# EAGLE design Protoboard (EAGLE 6.4)
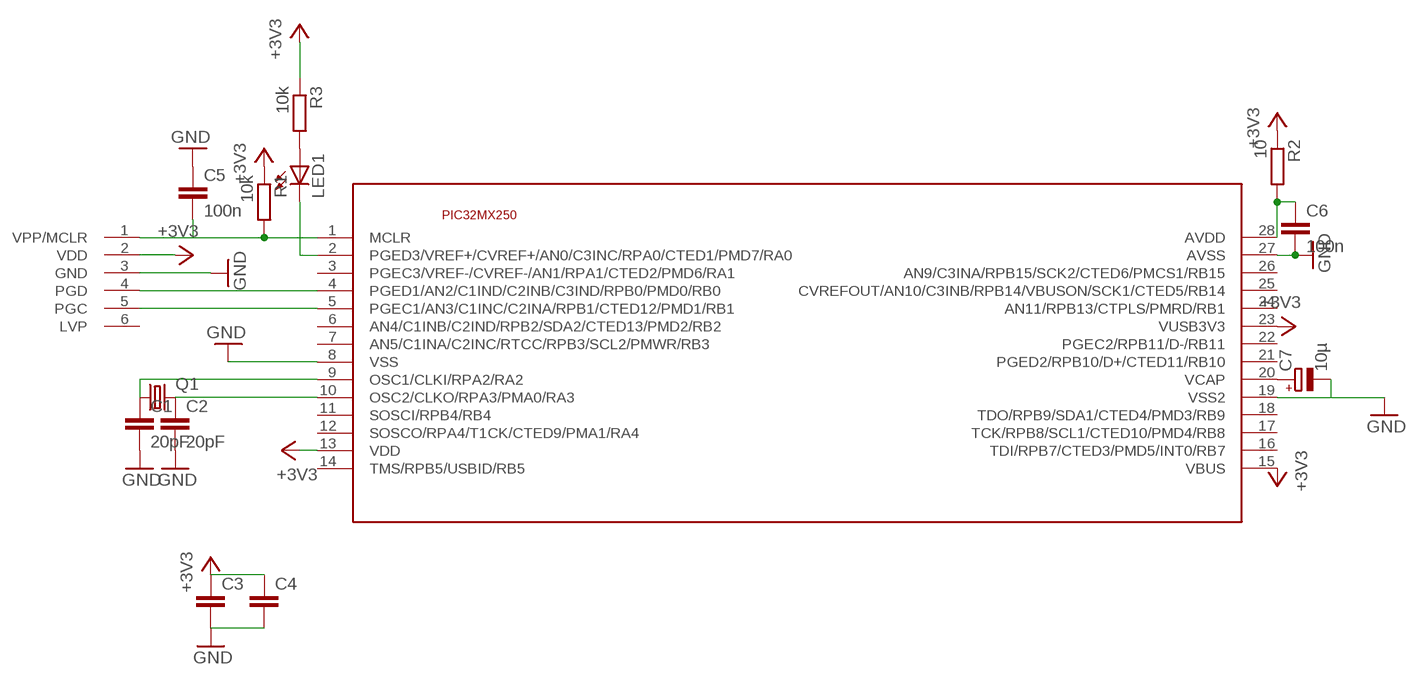
[diagram p0: schematic, sheet 1]

## Parts
C1  20pF  C-EU050-024X044  [C050-024X044]
C2  20pF  C-EU050-024X044  [C050-024X044]
C3  C-EU050-024X044  [C050-024X044]
C4  C-EU050-024X044  [C050-024X044]
C5  100n  C-EU050-024X044  [C050-024X044]
C6  100n  C-EU050-024X044  [C050-024X044]
C7  10µ  CPOL-EUB45181B  [B45181B]
LED1  LED5MM  [LED5MM]
Q1  CRYSTALTC26V  [TC26V]
R1  10k  R-EU_0207/10  [0207/10]
R2  10  R-EU_0207/10  [0207/10]
R3  10k  R-EU_0207/10  [0207/10]
U$2  ICSP-6_6P  [1X06-CLEANBIG]
U$3  PIC32MX2XXSOIC  [SOIC28]

## Nets
+3V3: C3.1 C4.1 R1.1 R2.1 R3.1 U$2.2(VDD) U$3.13(VDD) U$3.15(VBUS) U$3.23(VUSB3V3)
GND: C1.2 C2.2 C3.2 C4.2 C5.1 C6.2 C7.- U$2.3(GND) U$3.8(VSS) U$3.19(VSS2) U$3.27(AVSS)
N$1: C2.1 Q1.2 U$3.10(OSC2/CLKO/RPA3/PMA0/RA3)
N$2: C5.2 R1.2 U$2.1(VPP/MCLR) U$3.1(MCLR)
N$3: U$2.5(PGC) U$3.5(PGEC1/AN3/C1INC/C2INA/RPB1/CTED12/PMD1/RB1)
N$4: C1.1 Q1.1 U$3.9(OSC1/CLKI/RPA2/RA2)
N$5: U$2.4(PGD) U$3.4(PGED1/AN2/C1IND/C2INB/C3IND/RPB0/PMD0/RB0)
N$6: LED1.K(C) U$3.2(PGED3/VREF+/CVREF+/AN0/C3INC/RPA0/CTED1/PMD7/RA0)
N$7: C7.+ U$3.20(VCAP)
N$8: C6.1 R2.2 U$3.28(AVDD)
N$9: LED1.A R3.2
Unconnected: U$2.6(LVP) U$3.3(PGEC3/VREF-/CVREF-/AN1/RPA1/CTED2/PMD6/RA1) U$3.6(AN4/C1INB/C2IND/RPB2/SDA2/CTED13/PMD2/RB2) U$3.7(AN5/C1INA/C2INC/RTCC/RPB3/SCL2/PMWR/RB3) U$3.11(SOSCI/RPB4/RB4) U$3.12(SOSCO/RPA4/T1CK/CTED9/PMA1/RA4) U$3.14(TMS/RPB5/USBID/RB5) U$3.16(TDI/RPB7/CTED3/PMD5/INT0/RB7) U$3.17(TCK/RPB8/SCL1/CTED10/PMD4/RB8) U$3.18(TDO/RPB9/SDA1/CTED4/PMD3/RB9) U$3.21(PGED2/RPB10/D+/CTED11/RB10) U$3.22(PGEC2/RPB11/D-/RB11) U$3.24(AN11/RPB13/CTPLS/PMRD/RB1) U$3.25(CVREFOUT/AN10/C3INB/RPB14/VBUSON/SCK1/CTED5/RB14) U$3.26(AN9/C3INA/RPB15/SCK2/CTED6/PMCS1/RB15)

## Library data of the parts
C1-C6 = rcl:C-EU: CAPACITOR, European symbol
C7 = rcl:CPOL-EU: POLARIZED CAPACITOR, European symbol
LED1 = led:LED: LED OSRAM: - CHIPLED LG R971, LG N971, LY N971, LG Q971, LY Q971, LO R971, LY R971 LH N974, LH R974 LS Q976, LO Q976, LY Q976 LO Q996 - Hyper CHIPLED LW Q18S LB Q993, LB Q99A, LB R99A - SideLED LS A670, LO A670, LY A670, LG A670, LP A670 LB A673, LV A673, LT A673, LW A673 LH A674 LY A675 LS A676, LA A676, LO A676, LY A676, LW A676 LS A679, LY A679, LG A679 - Hyper Micro SIDELED® LS Y876, LA Y876, LO Y876, LY Y876 LT Y87S - SmartLED LW L88C, LW L88S LB L89C, LB L89S, LG L890 LS L89K, LO L89K, LY L89K LS L896, LA L896, LO L896, LY L896 - TOPLED LS T670, LO T670, LY T670, LG T670, LP T670 LSG T670, LSP T670, LSY T670, LOP T670, LYG T670 LG T671, LOG T671, LSG T671 LB T673, LV T673, LT T673, LW T673 LH T674 LS T676, LA T676, LO T676, LY T676, LB T676, LH T676, LSB T676, LW T676 LB T67C, LV T67C, LT T67C, LS T67K, LO T67K, LY T67K, LW E67C LS E67B, LA E67B, LO E67B, LY E67B, LB E67C, LV E67C, LT E67C LW T67C LS T679, LY T679, LG T679 LS T770, LO T770, LY T770, LG T770, LP T770 LB T773, LV T773, LT T773, LW T773 LH T774 LS E675, LA E675, LY E675, LS T675 LS T776, LA T776, LO T776, LY T776, LB T776 LHGB T686 LT T68C, LB T68C - Hyper Mini TOPLED® LB M676 - Mini TOPLED Santana® LG M470 LS M47K, LO M47K, LY M47K Source: http://www.osram.convergy.de LUXEON: - LUMILED® LXK2-PW12-R00, LXK2-PW12-S00, LXK2-PW14-U00, LXK2-PW14-V00 LXK2-PM12-R00, LXK2-PM12-S00, LXK2-PM14-U00 LXK2-PE12-Q00, LXK2-PE12-R00, LXK2-PE12-S00, LXK2-PE14-T00, LXK2-PE14-U00 LXK2-PB12-K00, LXK2-PB12-L00, LXK2-PB12-M00, LXK2-PB14-N00, LXK2-PB14-P00, LXK2-PB14-Q00 LXK2-PR12-L00, LXK2-PR12-M00, LXK2-PR14-Q00, LXK2-PR14-R00 LXK2-PD12-Q00, LXK2-PD12-R00, LXK2-PD12-S00 LXK2-PH12-R00, LXK2-PH12-S00 LXK2-PL12-P00, LXK2-PL12-Q00, LXK2-PL12-R00 Source: www.luxeon.com KINGBRIGHT: KA-3528ASYC Source: www.kingbright.com
Q1 = adafruit:CRYSTAL: CRYSTAL; OC_FARNELL: unknown; OC_NEWARK: unknown
R1-R3 = rcl:R-EU_: RESISTOR, European symbol
U$2 = lieven:ICSP-6
U$3 = lieven:PIC32MX2XX

## Board
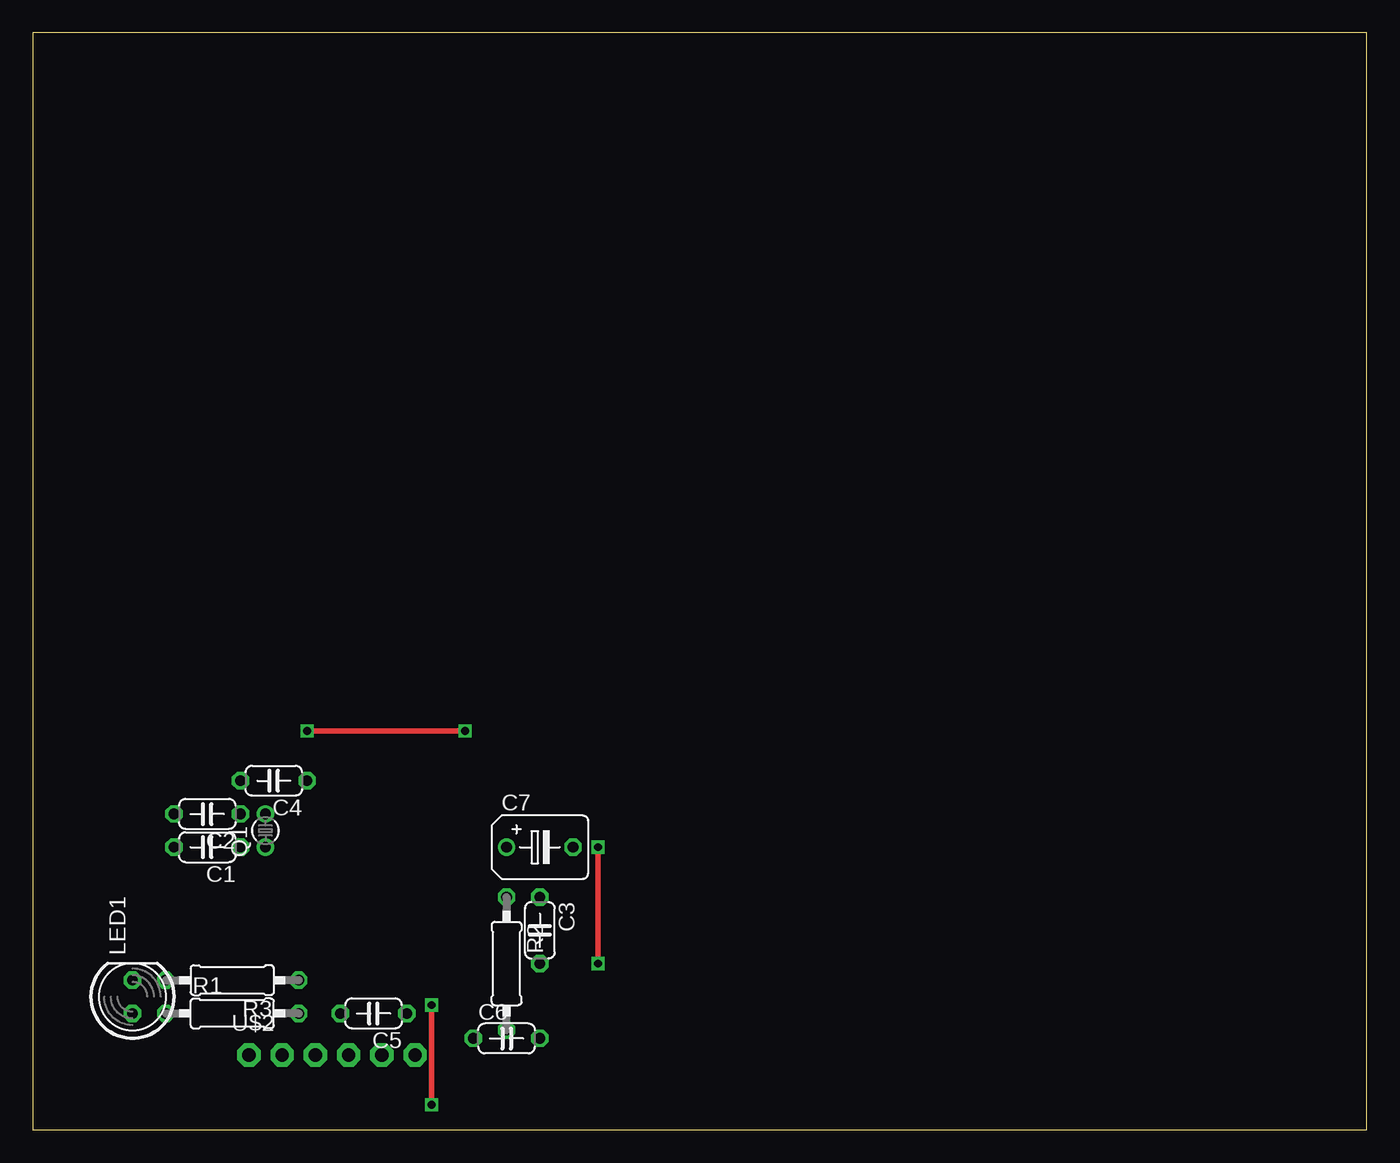
[diagram p1: board, top side]
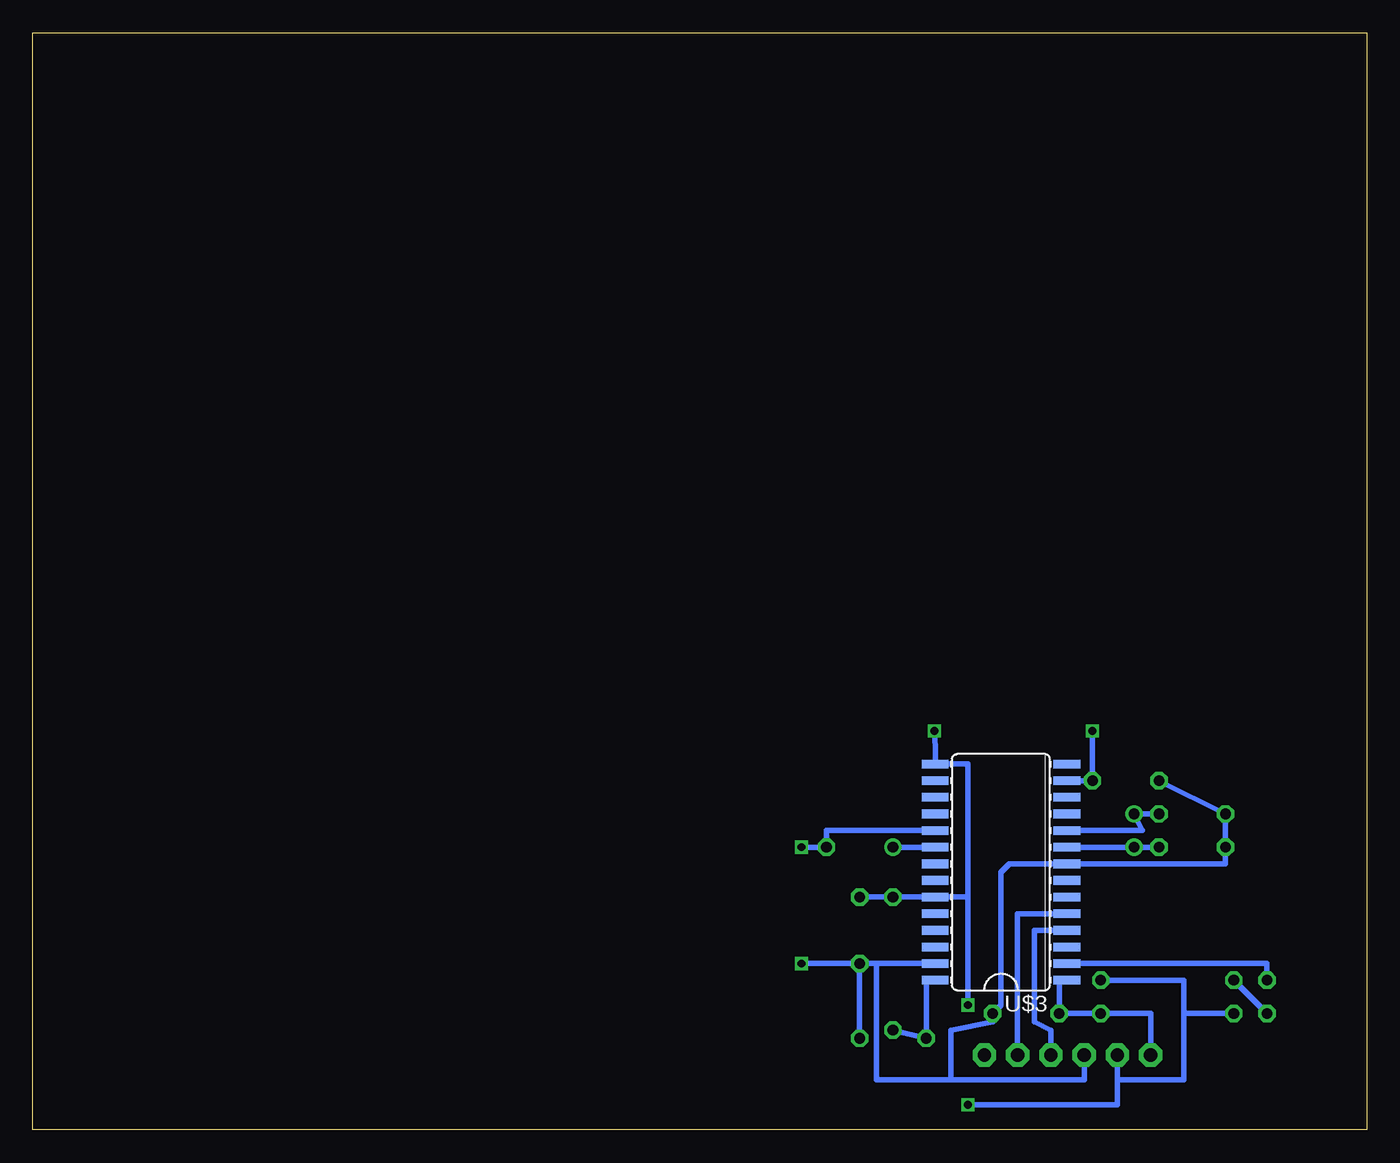
[diagram p2: board, bottom side, seen from below]

Size 101.91 x 83.81 mm. Coordinates in mm from the lower left corner, seen from the top.
Outline: 0,0 101.91,0 101.91,83.81 0,83.81 0,0
Copper layers (1*16): Top 0.035mm / dielectric 1.5mm / Bottom 0.035mm
Design rules "default": minimum track width 10mil, minimum drill 24mil, track to track 8mil, track to pad 8mil, pad to pad 8mil, via to via 8mil, smd to smd 8mil, copper to edge 40mil, drill to drill 8mil, minimum pad ring 10mil, minimum via ring 8mil, stop-mask expansion 4mil, vias tented up to drill 0mil, thermal gap 10mil

### Footprints (pad centres in the part's own frame; a part is rotated, then mirrored left to right if it is on the bottom)
C050-024X044 = drill 0.813 octagon: 1 -2.54,0; 2 2.54,0
B45181B = drill 0.813: + -2.54,0 | drill 0.813 octagon: - 2.54,0
LED5MM = drill 0.813 octagon: A -1.27,0; K 1.27,0
TC26V = drill 0.813: 1 -1.27,0; 2 1.27,0
0207/10 = drill 0.813 octagon: 1 -5.08,0; 2 5.08,0
1X06-CLEANBIG = drill 1.016 pad 1.778 octagon: 1 -6.35,0; 2 -3.81,0; 3 -1.27,0; 4 1.27,0; 5 3.81,0; 6 6.35,0
SOIC28 = smd 0.66 x 2.032: 1 -6.985,-5.029; 2 -5.715,-5.029; 3 -4.445,-5.029; 4 -3.175,-5.029; 5 -1.905,-5.029; 6 -0.635,-5.029; 7 0.635,-5.029; 8 1.905,-5.029; 9 3.175,-5.029; 10 4.445,-5.029; 11 5.715,-5.029; 12 6.985,-5.029; 13 8.255,-5.029; 14 9.525,-5.029; 15 9.525,5.029; 16 8.255,5.029; 17 6.985,5.029; 18 5.715,5.029; 19 4.445,5.029; 20 3.175,5.029; 21 1.905,5.029; 22 0.635,5.029; 23 -0.635,5.029; 24 -1.905,5.029; 25 -3.175,5.029; 26 -4.445,5.029; 27 -5.715,5.029; 28 -6.985,5.029

### Placement (x,y rotation side)
C1  13.34,21.59 180 top
C2  13.34,24.13 180 top
C3  38.73,15.24 270 top
C4  18.41,26.67 180 top
C5  26.04,8.89 180 top
C6  36.2,6.99 0 top
C7  38.73,21.59 0 top
LED1  7.62,10.16 90 top
Q1  17.78,22.86 90 top
R1  15.24,8.89 0 top
R2  36.2,12.7 270 top
R3  15.24,11.43 180 top
U$2  22.86,5.71 0 top
U$3  27.94,18.41 90 bottom

### Tracks (layer width: path | path; a pad name or v marks a point on that pad's centre or on a via)
+3V3  (via drill 0.6)
  Top 0.406: v33.02,30.48 v20.95,30.48 | v30.48,9.53 v30.48,1.91
  Bottom 0.406: U$3.13 C4.1 v20.95,30.48 | C3.1 R2.1 U$3.23 30.48,17.78 | v33.02,30.48 32.97,29.16 U$3.15 30.48,27.94 30.48,17.78 | R3.1 13.97,11.43 13.97,8.89 | 13.97,8.89 13.97,3.81 19.05,3.81 | 19.05,3.81 U$2.2 | 30.48,17.78 v30.48,9.53 | v30.48,1.91 19.05,1.91 19.05,3.81 | R1.1 13.97,8.89
GND  (via drill 0.6)
  Top 0.406: v43.18,21.59 v43.18,12.7
  Bottom 0.406: U$3.19 41.27,22.86 C7.- v43.18,21.59 | U$3.27 37.47,12.7 | C3.2 C6.2 | 37.47,12.7 37.47,3.81 31.75,3.81 | 37.47,12.7 C3.2 | C4.2 C2.2 C1.2 10.79,20.32 U$3.8 27.3,20.32 27.94,19.68 27.94,9.53 C5.1 28.57,8.26 31.75,7.62 31.75,3.81 | U$2.3 21.59,3.81 31.75,3.81 | v43.18,12.7 C3.2
N$1
  Bottom 0.406: C2.1 Q1.2 17.14,22.86 U$3.10
N$2
  Bottom 0.406: U$3.1 23.5,11.43 C5.2 R1.2 16.51,8.89 U$2.1
N$3
  Bottom 0.406: U$3.5 26.67,16.51 U$2.5
N$4
  Bottom 0.406: U$3.9 Q1.1 C1.1
N$5
  Bottom 0.406: U$2.4 24.13,7.62 25.4,8.26 25.4,15.24 U$3.4
N$6
  Bottom 0.406: LED1.K 7.62,12.7 U$3.2
N$7
  Bottom 0.406: C7.+ U$3.20
N$8
  Bottom 0.406: R2.2 C6.1 33.66,11.43 U$3.28
N$9
  Bottom 0.406: LED1.A R3.2